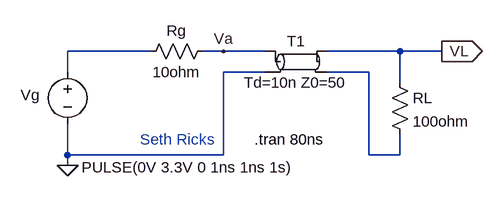
[diagram p0: schematic T-Line Lab Part 1.asc]
T-Line Lab Part 1.asc, the LTspice schematic file:
Version 4
SHEET 1 880 680
WIRE 96 96 -32 96
WIRE 208 96 176 96
WIRE 272 96 208 96
WIRE 480 96 368 96
WIRE 544 96 480 96
WIRE -32 128 -32 96
WIRE 272 128 208 128
WIRE 432 128 368 128
WIRE 480 144 480 96
WIRE -32 256 -32 208
WIRE 208 256 208 128
WIRE 208 256 -32 256
WIRE 432 256 432 128
WIRE 480 256 480 224
WIRE 480 256 432 256
WIRE -32 272 -32 256
FLAG -32 272 0
FLAG 544 96 VL
IOPIN 544 96 Out
FLAG 208 96 Va
SYMBOL res 192 80 R90
WINDOW 0 0 56 VBottom 2
WINDOW 3 32 56 VTop 2
SYMATTR InstName Rg
SYMATTR Value 10ohm
SYMBOL tline 320 112 R0
SYMATTR InstName T1
SYMATTR Value Td=10n Z0=50
SYMBOL res 464 128 R0
SYMATTR InstName RL
SYMATTR Value 100ohm
SYMBOL voltage -32 112 R0
WINDOW 0 -72 51 Left 2
WINDOW 3 22 163 Left 2
WINDOW 123 0 0 Left 0
WINDOW 39 0 0 Left 0
SYMATTR InstName Vg
SYMATTR Value PULSE(0V 3.3V 0 1ns 1ns 1s)
TEXT 80 232 Left 2 ;Seth Ricks
TEXT 256 232 Left 2 !.tran 80ns

The netlist it stands for:
* T-Line Lab Part 1.asc
Rg Va N001 10ohm
T1 Va 0 VL N002 Td=10n Z0=50
RL VL N002 100ohm
Vg N001 0 PULSE(0V 3.3V 0 1ns 1ns 1s)
* Seth Ricks
.tran 80ns
.backanno
.end

* Results of the author's LTspice run, read from the files saved beside the schematic
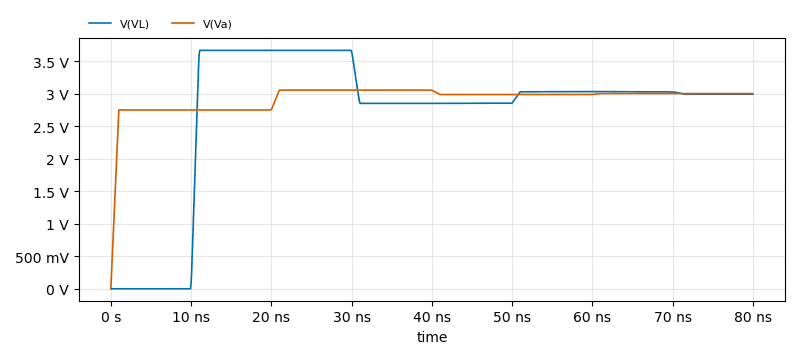
[diagram p1: Transient Analysis of T-Line Lab Part 1.asc, plotted from the saved traces]
* Transient Analysis, 1 run:
*   V(VL): min 0 V, max 3.667 V, average 2.743 V, rms 2.956 V, last 2.993 V
*   V(Va): min 0 V, max 3.056 V, average 2.93 V, rms 2.942 V, last 3.003 V